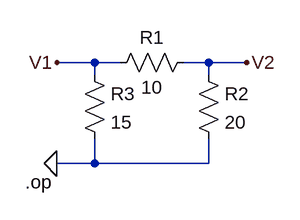
[diagram p0: schematic ejemplo1.asc]
ejemplo1.asc, the LTspice schematic file:
Version 4
SHEET 1 880 680
WIRE 176 80 128 80
WIRE 208 80 176 80
WIRE 320 80 288 80
WIRE 368 80 320 80
WIRE 176 96 176 80
WIRE 320 96 320 80
WIRE 176 208 176 176
WIRE 176 208 128 208
WIRE 320 208 320 176
WIRE 320 208 176 208
FLAG 128 208 0
FLAG 128 80 V1
FLAG 368 80 V2
SYMBOL res 304 64 R90
WINDOW 0 0 56 VBottom 2
WINDOW 3 32 56 VTop 2
SYMATTR InstName R1
SYMATTR Value 10
SYMBOL res 304 80 R0
SYMATTR InstName R2
SYMATTR Value 20
SYMBOL res 160 80 R0
SYMATTR InstName R3
SYMATTR Value 15
TEXT 88 232 Left 2 !.op

The netlist it stands for:
* ejemplo1.asc
R1 V2 V1 10
R2 V2 0 20
R3 V1 0 15
.op
.backanno
.end